# Altium schematic sheet Radio.SchDoc: Top Level
size A3; CompanyName: NOT USED; DocumentNumber: 8; SheetNumber: 8; SheetTotal: 10; PageSetup: Record=PageOptions|CenterHorizontal=True|CenterVertical=True|PrintScale=1.00|XCorrection=1.00|YCorrection=1.00|PrintKind=0|BorderSize=5000000|LeftOffset=0|BottomOffset=0|Orientation=2|PaperLength=1000|PaperWidth=1000|Scale=100|PaperSource=7|PrintQuality=-4|MediaType=1|DitherType=10|PaperKind=A3|PrintScaleMode=0
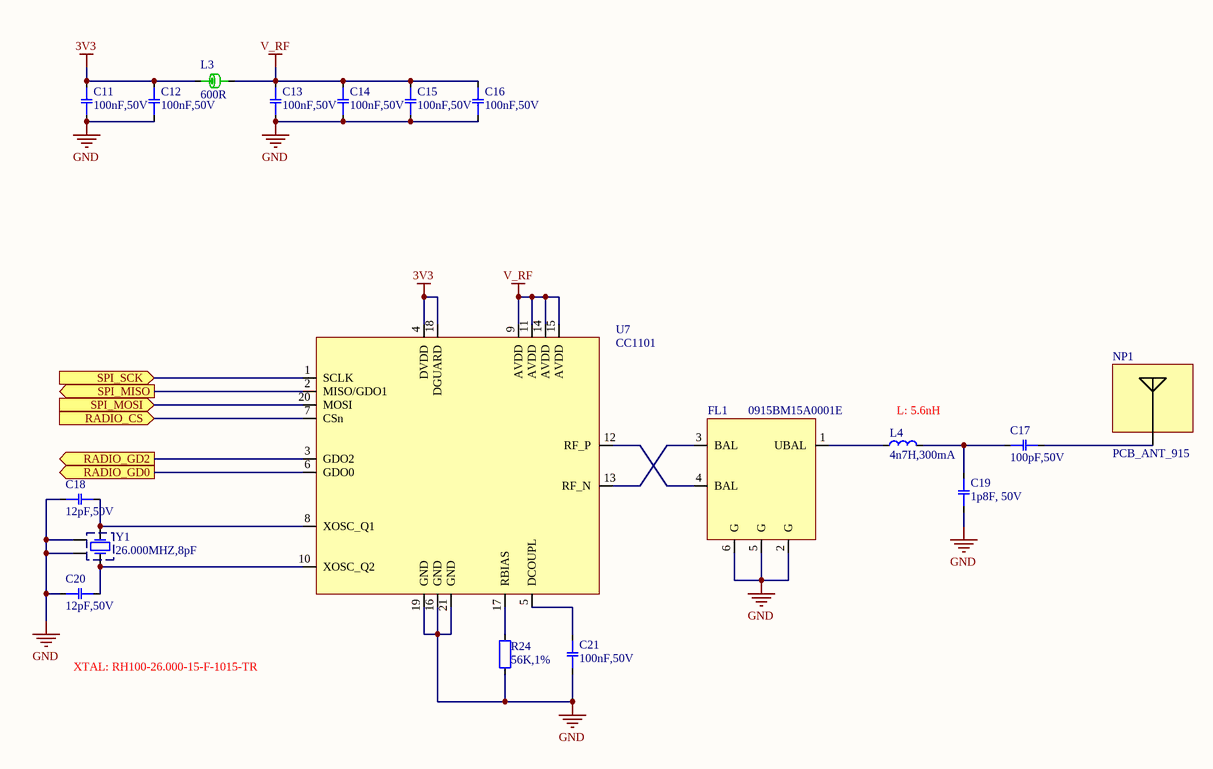
[diagram p0: Radio.SchDoc]

## Parts
C11  100nF,50V  [CAPC1005X05N_0402]
C12  100nF,50V  [CAPC1005X05N_0402]
C13  100nF,50V  [CAPC1005X05N_0402]
C14  100nF,50V  [CAPC1005X05N_0402]
C15  100nF,50V  [CAPC1005X05N_0402]
C16  100nF,50V  [CAPC1005X05N_0402]
C17  100pF,50V  [CAPC1005X05N_0402]
C18  12pF,50V  [CAPC1005X05N_0402]
C19  1p8F, 50V  [CAPC1005X05N_0402]
C20  12pF,50V  [CAPC1005X05N_0402]
C21  100nF,50V  [CAPC1005X05N_0402]
FL1  0915BM15A0001E  [FLTR65P200X125-6N_0805]
L3  600R  [INDC1608X10N_0603]
L4  4n7H,300mA  [INDC1005X04N_0402]
NP1  PCB_ANT_915  [ANT_PCB_915]
R24  56K,1%  [RESC1005X04N_0402]
U7  CC1101  [QFN50P400X400X75-20N_20QFN]
Y1  26.000MHZ,8pF  [XTAL_NX3225SA]

## Ports
RADIO_CS (in), RADIO_GD0 (out), RADIO_GD2 (out), SPI_MISO (out), SPI_MOSI (in), SPI_SCK (in)

## Nets
3V3: C11.2 C12.2 L3.1 U7.4(DVDD) U7.18(DGUARD)
GND: C11.1 C12.1 C13.1 C14.1 C15.1 C16.1 C18.1 C19.1 C20.1 C21.1 FL1.2(G) FL1.5(G) FL1.6(G) R24.1 U7.16(GND) U7.19(GND) U7.21(GND) Y1.2 Y1.4
V_RF: C13.2 C14.2 C15.2 C16.2 L3.2 U7.9(AVDD) U7.11(AVDD) U7.14(AVDD) U7.15(AVDD)
RADIO_CS: U7.7(CSn) ; port RADIO_CS
RADIO_GD0: U7.6(GDO0) ; port RADIO_GD0
RADIO_GD2: U7.3(GDO2) ; port RADIO_GD2
SPI_MISO: U7.2(MISO/GDO1) ; port SPI_MISO
SPI_MOSI: U7.20(MOSI) ; port SPI_MOSI
SPI_SCK: U7.1(SCLK) ; port SPI_SCK
NetC17_1: C17.1 C19.2 L4.2
NetC17_2: C17.2 NP1.1(ANT)
NetC18_2: C18.2 U7.8(XOSC_Q1) Y1.1
NetC20_2: C20.2 U7.10(XOSC_Q2) Y1.3
NetC21_2: C21.2 U7.5(DCOUPL)
NetFL1_1: FL1.1(UBAL) L4.1
NetFL1_3: FL1.3(BAL) U7.13(RF_N)
NetFL1_4: FL1.4(BAL) U7.12(RF_P)
NetR24_2: R24.2 U7.17(RBIAS)

## Notes on the sheet
- (near L4) L: 5.6nH
- XTAL: RH100-26.000-15-F-1015-TR
- Project
- Size:
- Date:
- A3
- Revision:
- Sheet
- of
- Lambo
- File:

## Library data of the parts
C11-C16 C21 = CCG-104DE-H: CAP CER 0.1UF 50V X7R 0402; Manufacturer: Taiyo Yuden; Manufacturer Part Number: UMK105B7104KV-FR; Tolerance: 10%; Type: Ceramic; Display_Name: 100nF,50V; Capacitance: 100nF; Dielectric: X7R; Voltage: 50V; BWA PN: CCG-104DE-H; Schematic Symbol: CAP-NP_1; Supplier 1: Digi-Key; Supplier Part Number 1: 587-3498-1-ND
C17 = CCG-101PAH-F: CAP CER 100PF 50V 5% NP0 0402; Manufacturer: Murata Electronics North America; Manufacturer Part Number: GRM1555C1H101JA01D; Dielectric: NPO; Type: Ceramic; Display_Name: 100pF,50V; Capacitance: 100pF; Tolerance: 5%; Voltage: 50V; BWA PN: CCG-101PAH-F; Schematic Symbol: CAP-NP_1; Supplier 1: Digi-Key; Supplier Part Number 1: 490-5922-1-ND
C18 C20 = CCG-12PAH-F: CAP CER 12PF 50V 5% NP0 0402; Manufacturer: Murata Electronics North America; Manufacturer Part Number: GRM1555C1H120JA01D; Dielectric: NPO; Type: Ceramic; Display_Name: 12pF,50V; Capacitance: 12pF; Tolerance: 5%; Voltage: 50V; BWA PN: CCG-12PAH-F; Schematic Symbol: CAP-NP_1; Supplier 1: Digi-Key; Supplier Part Number 1: 490-5924-1-ND
C19 = CCG-1P8AH-F: CAP CER 1.8PF 50V C0G/NP0 0402; Manufacturer: Murata Electronics North America; Manufacturer Part Number: GJM1555C1H1R8BB01D; Dielectric: Ceramic; Tolerance: ±0.1pF; Display_Name: 1p8F, 50V; Capacitance: 1p8F; Type: C0G/NP0; Voltage: 50V; BWA PN: CCG-1P8AH-F; Schematic Symbol: CAP-NP_1; Supplier 1: Digi-Key; Supplier Part Number 1: 490-8089-1-ND
FL1 = ICT-10614-A: BALUN 902MHZ-928MHZ 0805; Manufacturer: Johanson Technology Inc; Display_Name: 0915BM15A0001E; BWA PN: ICT-10614-A; Schematic Symbol: ____BM15A0001E; Manufacturer Part Number: 0915BM15A0001E; Supplier 1: Digi-Key; Supplier Part Number 1: 712-1541-1-ND
L3 = IND-10163-A: FERRITE BEAD 600 OHM 0603 1LN; Manufacturer: Wurth Electronics Inc; Manufacturer Part Number: 742792651; Inductance: 600Ohm @ 100MHz; Current Rating: 1A; DC Resistance: 200mOhm; Schematic Symbol: INDUCTOR_1; Display_Name: 600R; BWA PN: IND-10163-A; Supplier 1: Digi-Key; Supplier Part Number 1: 732-1593-1-ND
L4 = IND-10145-A: INDUCTOR 4.7NH 300MA 0402; Manufacturer: Murata Electronics North America; Manufacturer Part Number: LQG15HS4N7S02D; Sheilding: Unshielded; Type: Air; DC Resistance: 180mOhm; Display_Name: 4n7H,300mA; Inductance: 4n7H; BWA PN: IND-10145-A; Current Rating: 300mA; Schematic Symbol: INDUCTOR_1; Supplier 1: Digi-Key; Supplier Part Number 1: 490-2618-1-ND
R24 = RSG-56K00-D: RES 56.0K OHM 1/16W 1% 0402 SMD; Manufacturer: Yageo; Manufacturer Part Number: RC0402FR-0756KL; Power: 0.063W; Display_Name: 56K,1%; Resistance: 56K; Tolerance: 1%; Type: Chip; BWA PN: RSG-56K00-D; Schematic Symbol: RESISTOR_1; Supplier 1: Digi-Key; Supplier Part Number 1: 311-56.0KLRCT-ND
U7 = ICT-10885-A: IC RF TXRX ISM<1GHZ 20VFQFN; Manufacturer: Texas Instruments; Manufacturer Part Number: CC1101RGPR; Temp Range: -40°C ~ 85°C; Display_Name: CC1101; BWA PN: ICT-10885-A; Schematic Symbol: CC1101; Supplier 1: Digi-Key; Supplier Part Number 1: 296-35718-1-ND
Y1 = XTL-10058-A: CRYSTAL 26MHZ 8PF SMD; Manufacturer: NDK; Manufacturer Part Number: NX3225SA-26.000000MHZ-STD-CSR-1; Accuracy: ±15ppm; Display_Name: 26.000MHZ,8pF; Frequency: 26MHz; Type: Fundamental; BWA PN: XTL-10058-A; Load Capacitance: 8pF; Schematic Symbol: XTAL_2; Supplier 1: Digi-Key; Supplier Part Number 1: 644-1054-1-ND